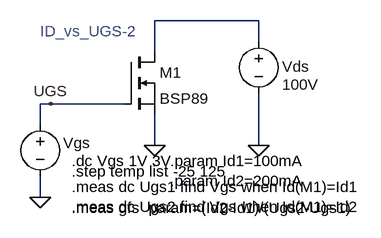
[diagram p0: schematic ID_vs_UGS-2.asc]
ID_vs_UGS-2.asc, the LTspice schematic file:
Version 4
SHEET 1 1292 680
WIRE -560 -176 -720 -176
WIRE -560 -144 -560 -176
WIRE -720 -128 -720 -176
WIRE -880 -48 -896 -48
WIRE -768 -48 -880 -48
WIRE -896 -16 -896 -48
WIRE -720 16 -720 -32
WIRE -560 16 -560 -64
WIRE -896 96 -896 64
FLAG -560 16 0
FLAG -896 96 0
FLAG -720 16 0
FLAG -880 -48 UGS
SYMBOL voltage -560 -160 R0
WINDOW 123 0 0 Left 2
WINDOW 39 37 60 Left 2
WINDOW 0 36 55 Left 2
WINDOW 3 36 82 Left 2
SYMATTR InstName Vds
SYMATTR Value 100V
SYMBOL voltage -896 -32 R0
WINDOW 123 0 0 Left 2
WINDOW 39 40 53 Left 2
WINDOW 3 -97 181 Left 2
WINDOW 0 35 44 Left 2
SYMATTR Value ""
SYMATTR InstName Vgs
SYMBOL nmos -768 -128 R0
SYMATTR InstName M1
SYMATTR Value BSP89
TEXT -848 40 Left 2 !.dc Vgs 1V 3V
TEXT -848 56 Left 2 !.step temp list -25 125
TEXT -896 -160 Left 2 ;ID_vs_UGS-2
TEXT -848 80 Left 2 !.meas dc Ugs1 find Vgs when Id(M1)=Id1\n.meas dc Ugs2 find Vgs when Id(M1)=Id2
TEXT -848 112 Left 2 !.meas gfs  param=(Id2-Id1)/(Ugs2-Ugs1)
TEXT -696 40 Left 2 !.param Id1=100mA\n.param Id2=200mA

The netlist it stands for:
* ID_vs_UGS-2.asc
Vds N001 0 100V
Vgs UGS 0
M1 N001 UGS 0 0 BSP89
.model NMOS NMOS
.model PMOS PMOS
.lib standard.mos
.dc Vgs 1V 3V
.step temp list -25 125
* ID_vs_UGS-2
.meas dc Ugs1 find Vgs when Id(M1)=Id1
.meas dc Ugs2 find Vgs when Id(M1)=Id2
.meas gfs  param=(Id2-Id1)/(Ugs2-Ugs1)
.param Id1=100mA
.param Id2=200mA
.backanno
.end